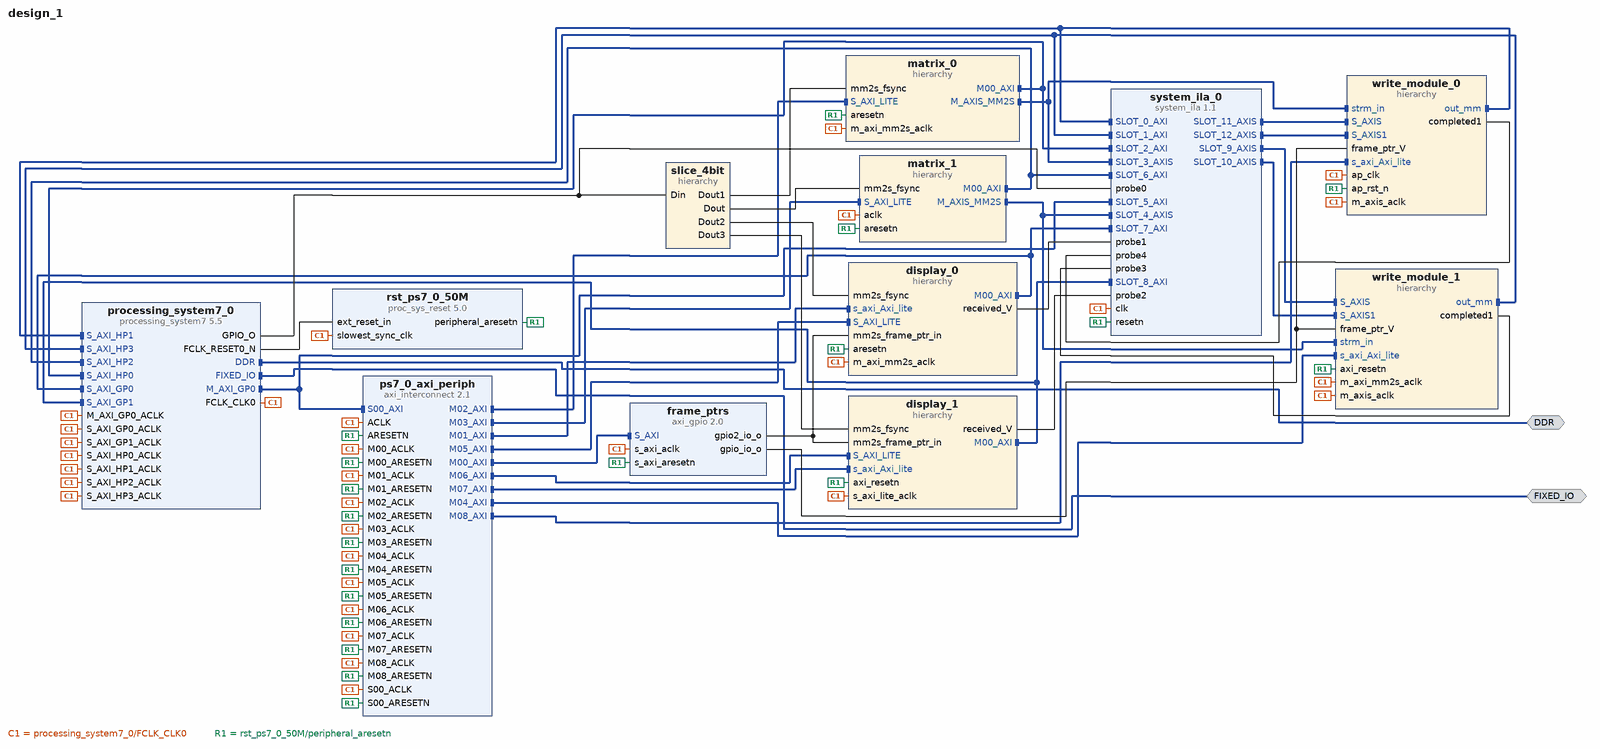
[diagram p0: block diagram of the top level]
# Vivado block design design_1, xc7z020clg400-1, Vivado 2023.1
create_bd_design design_1

create_bd_intf_port -mode Master -vlnv xilinx.com:interface:ddrx_rtl:1.0 DDR
create_bd_intf_port -mode Master -vlnv xilinx.com:display_processing_system7:fixedio_rtl:1.0 FIXED_IO

create_bd_cell -type hier display_0
create_bd_cell -type hier display_1
create_bd_cell -type ip -vlnv xilinx.com:ip:axi_gpio:2.0 frame_ptrs
set_property -dict [list \
  CONFIG.C_ALL_OUTPUTS 1 \
  CONFIG.C_ALL_OUTPUTS_2 1 \
  CONFIG.C_GPIO2_WIDTH 6 \
  CONFIG.C_GPIO_WIDTH 2 \
  CONFIG.C_IS_DUAL 1 \
] [get_bd_cells frame_ptrs]
create_bd_cell -type hier matrix_0
create_bd_cell -type hier matrix_1
create_bd_cell -type ip -vlnv xilinx.com:ip:processing_system7:5.5 processing_system7_0
set_property -dict [list \
  CONFIG.PCW_APU_PERIPHERAL_FREQMHZ 667 \
  CONFIG.PCW_ENET0_ENET0_IO {MIO 16 .. 27} \
  CONFIG.PCW_ENET0_GRP_MDIO_ENABLE 1 \
  CONFIG.PCW_ENET0_GRP_MDIO_IO {MIO 52 .. 53} \
  CONFIG.PCW_ENET0_PERIPHERAL_ENABLE 1 \
  CONFIG.PCW_ENET0_RESET_ENABLE 0 \
  CONFIG.PCW_ENET_RESET_ENABLE 1 \
  CONFIG.PCW_ENET_RESET_SELECT {Share reset pin} \
  CONFIG.PCW_FPGA0_PERIPHERAL_FREQMHZ 100 \
  CONFIG.PCW_FPGA1_PERIPHERAL_FREQMHZ 100 \
  CONFIG.PCW_FPGA2_PERIPHERAL_FREQMHZ 100 \
  CONFIG.PCW_GPIO_EMIO_GPIO_ENABLE 1 \
  CONFIG.PCW_GPIO_EMIO_GPIO_IO 4 \
  CONFIG.PCW_GPIO_EMIO_GPIO_WIDTH 4 \
  CONFIG.PCW_GPIO_MIO_GPIO_ENABLE 1 \
  CONFIG.PCW_GPIO_MIO_GPIO_IO MIO \
  CONFIG.PCW_I2C_RESET_ENABLE 1 \
  CONFIG.PCW_PRESET_BANK1_VOLTAGE {LVCMOS 1.8V} \
  CONFIG.PCW_QSPI_GRP_FBCLK_ENABLE 1 \
  CONFIG.PCW_QSPI_GRP_FBCLK_IO {MIO 8} \
  CONFIG.PCW_QSPI_GRP_SINGLE_SS_ENABLE 1 \
  CONFIG.PCW_QSPI_GRP_SINGLE_SS_IO {MIO 1 .. 6} \
  CONFIG.PCW_QSPI_PERIPHERAL_ENABLE 1 \
  CONFIG.PCW_QSPI_QSPI_IO {MIO 1 .. 6} \
  CONFIG.PCW_SD0_GRP_CD_ENABLE 1 \
  CONFIG.PCW_SD0_GRP_CD_IO {MIO 47} \
  CONFIG.PCW_SD0_GRP_WP_ENABLE 0 \
  CONFIG.PCW_SD0_PERIPHERAL_ENABLE 1 \
  CONFIG.PCW_SD0_SD0_IO {MIO 40 .. 45} \
  CONFIG.PCW_SDIO_PERIPHERAL_FREQMHZ 50 \
  CONFIG.PCW_SINGLE_QSPI_DATA_MODE x4 \
  CONFIG.PCW_S_AXI_HP1_DATA_WIDTH 32 \
  CONFIG.PCW_S_AXI_HP3_DATA_WIDTH 32 \
  CONFIG.PCW_UART1_PERIPHERAL_ENABLE 1 \
  CONFIG.PCW_UART1_UART1_IO {MIO 48 .. 49} \
  CONFIG.PCW_UART_PERIPHERAL_FREQMHZ 100 \
  CONFIG.PCW_UIPARAM_DDR_FREQ_MHZ 533.333333 \
  CONFIG.PCW_UIPARAM_DDR_MEMORY_TYPE {DDR 3 (Low Voltage)} \
  CONFIG.PCW_UIPARAM_DDR_PARTNO {MT41K256M16 RE-125} \
  CONFIG.PCW_USB0_PERIPHERAL_ENABLE 1 \
  CONFIG.PCW_USB0_RESET_ENABLE 1 \
  CONFIG.PCW_USB0_RESET_IO {MIO 46} \
  CONFIG.PCW_USB0_USB0_IO {MIO 28 .. 39} \
  CONFIG.PCW_USB_RESET_ENABLE 1 \
  CONFIG.PCW_USB_RESET_SELECT {Share reset pin} \
  CONFIG.PCW_USE_S_AXI_GP0 1 \
  CONFIG.PCW_USE_S_AXI_GP1 1 \
  CONFIG.PCW_USE_S_AXI_HP0 1 \
  CONFIG.PCW_USE_S_AXI_HP1 1 \
  CONFIG.PCW_USE_S_AXI_HP2 1 \
  CONFIG.PCW_USE_S_AXI_HP3 1 \
] [get_bd_cells processing_system7_0]
# 298 more settings of processing_system7_0 are not shown: defaults, MIO pin electricals, DDR timing, and values the tool derives
create_bd_cell -type ip -vlnv xilinx.com:ip:axi_interconnect:2.1 ps7_0_axi_periph
set_property -dict {CONFIG.NUM_MI 9} [get_bd_cells ps7_0_axi_periph]
create_bd_cell -type ip -vlnv xilinx.com:ip:proc_sys_reset:5.0 rst_ps7_0_50M
create_bd_cell -type hier slice_4bit
create_bd_cell -type ip -vlnv xilinx.com:ip:system_ila:1.1 system_ila_0
set_property -dict [list \
  CONFIG.C_DATA_DEPTH 2048 \
  CONFIG.C_MON_TYPE MIX \
  CONFIG.C_NUM_MONITOR_SLOTS 13 \
  CONFIG.C_NUM_OF_PROBES 5 \
  CONFIG.C_PROBE1_TYPE 0 \
  CONFIG.C_PROBE2_TYPE 0 \
  CONFIG.C_PROBE3_TYPE 0 \
  CONFIG.C_PROBE4_TYPE 0 \
  CONFIG.C_SLOT 6 \
  CONFIG.C_SLOT_0_APC_EN 0 \
  CONFIG.C_SLOT_0_AXI_AR_SEL_DATA 1 \
  CONFIG.C_SLOT_0_AXI_AR_SEL_TRIG 1 \
  CONFIG.C_SLOT_0_AXI_AW_SEL_DATA 1 \
  CONFIG.C_SLOT_0_AXI_AW_SEL_TRIG 1 \
  CONFIG.C_SLOT_0_AXI_B_SEL_DATA 1 \
  CONFIG.C_SLOT_0_AXI_B_SEL_TRIG 1 \
  CONFIG.C_SLOT_0_AXI_R_SEL_DATA 1 \
  CONFIG.C_SLOT_0_AXI_R_SEL_TRIG 1 \
  CONFIG.C_SLOT_0_AXI_W_SEL_DATA 1 \
  CONFIG.C_SLOT_0_AXI_W_SEL_TRIG 1 \
  CONFIG.C_SLOT_0_INTF_TYPE xilinx.com:interface:aximm_rtl:1.0 \
  CONFIG.C_SLOT_10_APC_EN 0 \
  CONFIG.C_SLOT_10_AXI_DATA_SEL 1 \
  CONFIG.C_SLOT_10_AXI_TRIG_SEL 1 \
  CONFIG.C_SLOT_10_INTF_TYPE xilinx.com:interface:axis_rtl:1.0 \
  CONFIG.C_SLOT_11_APC_EN 0 \
  CONFIG.C_SLOT_11_AXI_DATA_SEL 1 \
  CONFIG.C_SLOT_11_AXI_TRIG_SEL 1 \
  CONFIG.C_SLOT_11_INTF_TYPE xilinx.com:interface:axis_rtl:1.0 \
  CONFIG.C_SLOT_12_APC_EN 0 \
  CONFIG.C_SLOT_12_AXI_DATA_SEL 1 \
  CONFIG.C_SLOT_12_AXI_TRIG_SEL 1 \
  CONFIG.C_SLOT_12_INTF_TYPE xilinx.com:interface:axis_rtl:1.0 \
  CONFIG.C_SLOT_1_APC_EN 0 \
  CONFIG.C_SLOT_1_AXI_AR_SEL_DATA 1 \
  CONFIG.C_SLOT_1_AXI_AR_SEL_TRIG 1 \
  CONFIG.C_SLOT_1_AXI_AW_SEL_DATA 1 \
  CONFIG.C_SLOT_1_AXI_AW_SEL_TRIG 1 \
  CONFIG.C_SLOT_1_AXI_B_SEL_DATA 1 \
  CONFIG.C_SLOT_1_AXI_B_SEL_TRIG 1 \
  CONFIG.C_SLOT_1_AXI_R_SEL_DATA 1 \
  CONFIG.C_SLOT_1_AXI_R_SEL_TRIG 1 \
  CONFIG.C_SLOT_1_AXI_W_SEL_DATA 1 \
  CONFIG.C_SLOT_1_AXI_W_SEL_TRIG 1 \
  CONFIG.C_SLOT_1_INTF_TYPE xilinx.com:interface:aximm_rtl:1.0 \
  CONFIG.C_SLOT_2_APC_EN 0 \
  CONFIG.C_SLOT_2_AXI_AR_SEL_DATA 1 \
  CONFIG.C_SLOT_2_AXI_AR_SEL_TRIG 1 \
  CONFIG.C_SLOT_2_AXI_AW_SEL_DATA 0 \
  CONFIG.C_SLOT_2_AXI_AW_SEL_TRIG 0 \
  CONFIG.C_SLOT_2_AXI_B_SEL_DATA 0 \
  CONFIG.C_SLOT_2_AXI_B_SEL_TRIG 0 \
  CONFIG.C_SLOT_2_AXI_R_SEL_DATA 1 \
  CONFIG.C_SLOT_2_AXI_R_SEL_TRIG 0 \
  CONFIG.C_SLOT_2_AXI_W_SEL_DATA 0 \
  CONFIG.C_SLOT_2_AXI_W_SEL_TRIG 0 \
  CONFIG.C_SLOT_2_INTF_TYPE xilinx.com:interface:aximm_rtl:1.0 \
  CONFIG.C_SLOT_3_APC_EN 0 \
  CONFIG.C_SLOT_3_AXI_DATA_SEL 1 \
  CONFIG.C_SLOT_3_AXI_TRIG_SEL 1 \
  CONFIG.C_SLOT_3_INTF_TYPE xilinx.com:interface:axis_rtl:1.0 \
  CONFIG.C_SLOT_4_APC_EN 0 \
  CONFIG.C_SLOT_4_AXI_DATA_SEL 1 \
  CONFIG.C_SLOT_4_AXI_TRIG_SEL 1 \
  CONFIG.C_SLOT_4_INTF_TYPE xilinx.com:interface:axis_rtl:1.0 \
  CONFIG.C_SLOT_5_APC_EN 0 \
  CONFIG.C_SLOT_5_AXI_AR_SEL_DATA 1 \
  CONFIG.C_SLOT_5_AXI_AR_SEL_TRIG 0 \
  CONFIG.C_SLOT_5_AXI_AW_SEL_DATA 1 \
  CONFIG.C_SLOT_5_AXI_AW_SEL_TRIG 0 \
  CONFIG.C_SLOT_5_AXI_B_SEL_DATA 1 \
  CONFIG.C_SLOT_5_AXI_B_SEL_TRIG 0 \
  CONFIG.C_SLOT_5_AXI_R_SEL_DATA 1 \
  CONFIG.C_SLOT_5_AXI_R_SEL_TRIG 1 \
  CONFIG.C_SLOT_5_AXI_W_SEL_DATA 1 \
  CONFIG.C_SLOT_5_AXI_W_SEL_TRIG 0 \
  CONFIG.C_SLOT_5_INTF_TYPE xilinx.com:interface:aximm_rtl:1.0 \
  CONFIG.C_SLOT_6_APC_EN 0 \
  CONFIG.C_SLOT_6_AXI_AR_SEL_DATA 1 \
  CONFIG.C_SLOT_6_AXI_AR_SEL_TRIG 1 \
  CONFIG.C_SLOT_6_AXI_AW_SEL 0 \
  CONFIG.C_SLOT_6_AXI_AW_SEL_DATA 0 \
  CONFIG.C_SLOT_6_AXI_AW_SEL_TRIG 0 \
  CONFIG.C_SLOT_6_AXI_B_SEL 1 \
  CONFIG.C_SLOT_6_AXI_B_SEL_DATA 0 \
  CONFIG.C_SLOT_6_AXI_B_SEL_TRIG 1 \
  CONFIG.C_SLOT_6_AXI_R_SEL_DATA 1 \
  CONFIG.C_SLOT_6_AXI_R_SEL_TRIG 1 \
  CONFIG.C_SLOT_6_AXI_W_SEL 1 \
  CONFIG.C_SLOT_6_AXI_W_SEL_DATA 0 \
  CONFIG.C_SLOT_6_AXI_W_SEL_TRIG 1 \
  CONFIG.C_SLOT_6_INTF_TYPE xilinx.com:interface:aximm_rtl:1.0 \
  CONFIG.C_SLOT_7_APC_EN 0 \
  CONFIG.C_SLOT_7_AXI_AR_SEL_DATA 1 \
  CONFIG.C_SLOT_7_AXI_AR_SEL_TRIG 1 \
  CONFIG.C_SLOT_7_AXI_AW_SEL 0 \
  CONFIG.C_SLOT_7_AXI_AW_SEL_DATA 0 \
  CONFIG.C_SLOT_7_AXI_AW_SEL_TRIG 0 \
  CONFIG.C_SLOT_7_AXI_B_SEL 0 \
  CONFIG.C_SLOT_7_AXI_B_SEL_DATA 0 \
  CONFIG.C_SLOT_7_AXI_B_SEL_TRIG 0 \
  CONFIG.C_SLOT_7_AXI_R_SEL_DATA 1 \
  CONFIG.C_SLOT_7_AXI_R_SEL_TRIG 0 \
  CONFIG.C_SLOT_7_AXI_W_SEL 1 \
  CONFIG.C_SLOT_7_AXI_W_SEL_DATA 0 \
  CONFIG.C_SLOT_7_AXI_W_SEL_TRIG 1 \
  CONFIG.C_SLOT_7_INTF_TYPE xilinx.com:interface:aximm_rtl:1.0 \
  CONFIG.C_SLOT_8_APC_EN 0 \
  CONFIG.C_SLOT_8_AXI_AR_SEL_DATA 1 \
  CONFIG.C_SLOT_8_AXI_AR_SEL_TRIG 1 \
  CONFIG.C_SLOT_8_AXI_AW_SEL_DATA 0 \
  CONFIG.C_SLOT_8_AXI_AW_SEL_TRIG 0 \
  CONFIG.C_SLOT_8_AXI_B_SEL_DATA 0 \
  CONFIG.C_SLOT_8_AXI_B_SEL_TRIG 0 \
  CONFIG.C_SLOT_8_AXI_R_SEL_DATA 1 \
  CONFIG.C_SLOT_8_AXI_R_SEL_TRIG 0 \
  CONFIG.C_SLOT_8_AXI_W_SEL_DATA 0 \
  CONFIG.C_SLOT_8_AXI_W_SEL_TRIG 0 \
  CONFIG.C_SLOT_8_INTF_TYPE xilinx.com:interface:aximm_rtl:1.0 \
  CONFIG.C_SLOT_9_APC_EN 0 \
  CONFIG.C_SLOT_9_AXI_DATA_SEL 1 \
  CONFIG.C_SLOT_9_AXI_TRIG_SEL 1 \
  CONFIG.C_SLOT_9_INTF_TYPE xilinx.com:interface:axis_rtl:1.0 \
] [get_bd_cells system_ila_0]
create_bd_cell -type hier write_module_0
create_bd_cell -type hier write_module_1

# ---- hierarchy /display_0 ----
current_bd_instance /display_0
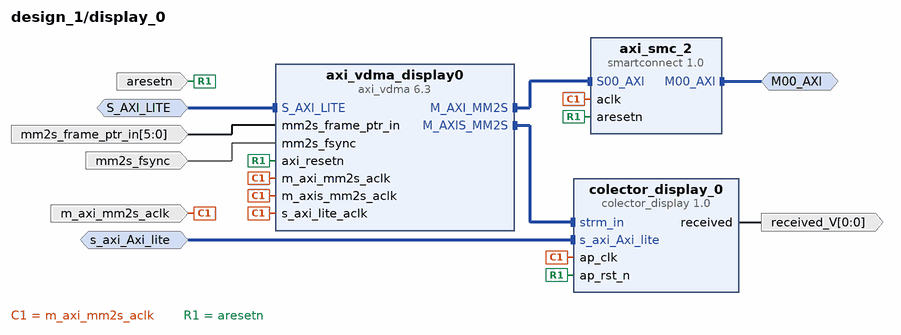
[diagram p1: block diagram inside /display_0]
create_bd_intf_pin -mode Master -vlnv xilinx.com:interface:aximm_rtl:1.0 M00_AXI
create_bd_intf_pin -mode Slave -vlnv xilinx.com:interface:aximm_rtl:1.0 S_AXI_LITE
create_bd_intf_pin -mode Slave -vlnv xilinx.com:interface:aximm_rtl:1.0 s_axi_Axi_lite
create_bd_pin -dir I -type rst aresetn
create_bd_pin -dir I -type clk m_axi_mm2s_aclk
create_bd_pin -dir I -from 5 -to 0 mm2s_frame_ptr_in
create_bd_pin -dir I mm2s_fsync
create_bd_pin -dir O -from 0 -to 0 -type data received_V

create_bd_cell -type ip -vlnv xilinx.com:ip:smartconnect:1.0 axi_smc_2
set_property -dict {CONFIG.NUM_SI 1} [get_bd_cells axi_smc_2]
create_bd_cell -type ip -vlnv xilinx.com:ip:axi_vdma:6.3 axi_vdma_display0
set_property -dict [list \
  CONFIG.c_include_s2mm 0 \
  CONFIG.c_m_axis_mm2s_tdata_width 64 \
  CONFIG.c_mm2s_genlock_mode 1 \
  CONFIG.c_mm2s_linebuffer_depth 1024 \
  CONFIG.c_mm2s_max_burst_length 256 \
  CONFIG.c_num_fstores 4 \
  CONFIG.c_use_mm2s_fsync 1 \
] [get_bd_cells axi_vdma_display0]
create_bd_cell -type ip -vlnv xilinx.com:hls:colector_display:1.0 colector_display_0

# ---- hierarchy /display_1 ----
current_bd_instance /display_1
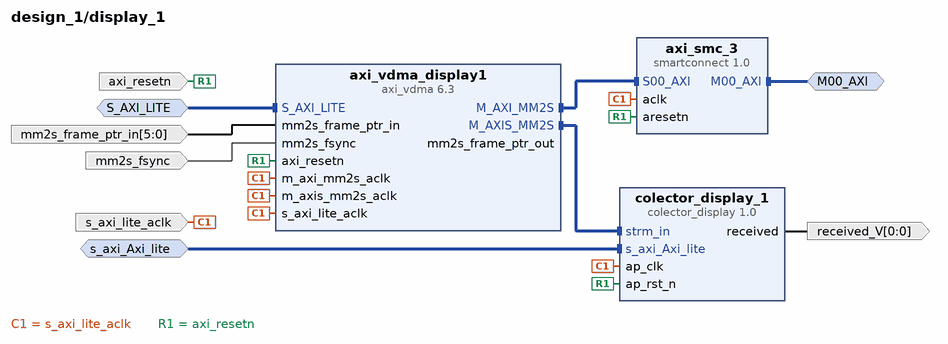
[diagram p2: block diagram inside /display_1]
create_bd_intf_pin -mode Master -vlnv xilinx.com:interface:aximm_rtl:1.0 M00_AXI
create_bd_intf_pin -mode Slave -vlnv xilinx.com:interface:aximm_rtl:1.0 S_AXI_LITE
create_bd_intf_pin -mode Slave -vlnv xilinx.com:interface:aximm_rtl:1.0 s_axi_Axi_lite
create_bd_pin -dir I -type rst axi_resetn
create_bd_pin -dir I -from 5 -to 0 mm2s_frame_ptr_in
create_bd_pin -dir I mm2s_fsync
create_bd_pin -dir O -from 0 -to 0 -type data received_V
create_bd_pin -dir I -type clk s_axi_lite_aclk

create_bd_cell -type ip -vlnv xilinx.com:ip:smartconnect:1.0 axi_smc_3
set_property -dict {CONFIG.NUM_SI 1} [get_bd_cells axi_smc_3]
create_bd_cell -type ip -vlnv xilinx.com:ip:axi_vdma:6.3 axi_vdma_display1
set_property -dict [list \
  CONFIG.c_include_s2mm 0 \
  CONFIG.c_m_axis_mm2s_tdata_width 64 \
  CONFIG.c_mm2s_genlock_mode 1 \
  CONFIG.c_mm2s_linebuffer_depth 1024 \
  CONFIG.c_mm2s_max_burst_length 256 \
  CONFIG.c_num_fstores 4 \
  CONFIG.c_use_mm2s_fsync 1 \
] [get_bd_cells axi_vdma_display1]
create_bd_cell -type ip -vlnv xilinx.com:hls:colector_display:1.0 colector_display_1

# ---- hierarchy /matrix_0 ----
current_bd_instance /matrix_0
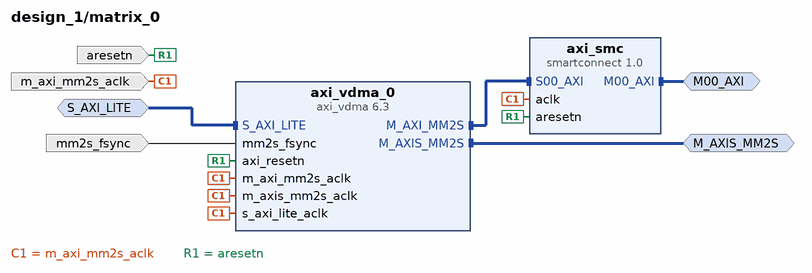
[diagram p3: block diagram inside /matrix_0]
create_bd_intf_pin -mode Master -vlnv xilinx.com:interface:aximm_rtl:1.0 M00_AXI
create_bd_intf_pin -mode Master -vlnv xilinx.com:interface:axis_rtl:1.0 M_AXIS_MM2S
create_bd_intf_pin -mode Slave -vlnv xilinx.com:interface:aximm_rtl:1.0 S_AXI_LITE
create_bd_pin -dir I -type rst aresetn
create_bd_pin -dir I -type clk m_axi_mm2s_aclk
create_bd_pin -dir I mm2s_fsync

create_bd_cell -type ip -vlnv xilinx.com:ip:smartconnect:1.0 axi_smc
set_property -dict {CONFIG.NUM_SI 1} [get_bd_cells axi_smc]
create_bd_cell -type ip -vlnv xilinx.com:ip:axi_vdma:6.3 axi_vdma_0
set_property -dict [list \
  CONFIG.c_include_s2mm 0 \
  CONFIG.c_m_axis_mm2s_tdata_width 64 \
  CONFIG.c_mm2s_genlock_mode 0 \
  CONFIG.c_num_fstores 1 \
  CONFIG.c_use_mm2s_fsync 1 \
] [get_bd_cells axi_vdma_0]

# ---- hierarchy /matrix_1 ----
current_bd_instance /matrix_1
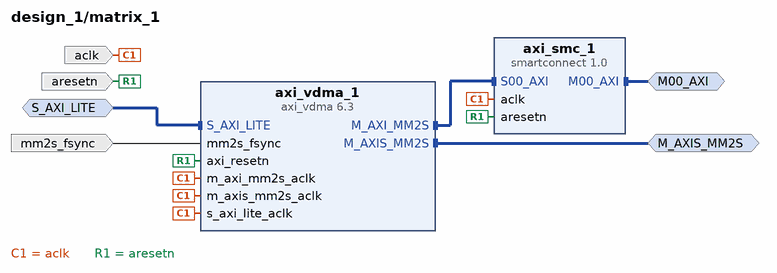
[diagram p4: block diagram inside /matrix_1]
create_bd_intf_pin -mode Master -vlnv xilinx.com:interface:aximm_rtl:1.0 M00_AXI
create_bd_intf_pin -mode Master -vlnv xilinx.com:interface:axis_rtl:1.0 M_AXIS_MM2S
create_bd_intf_pin -mode Slave -vlnv xilinx.com:interface:aximm_rtl:1.0 S_AXI_LITE
create_bd_pin -dir I -type clk aclk
create_bd_pin -dir I -type rst aresetn
create_bd_pin -dir I mm2s_fsync

create_bd_cell -type ip -vlnv xilinx.com:ip:smartconnect:1.0 axi_smc_1
set_property -dict {CONFIG.NUM_SI 1} [get_bd_cells axi_smc_1]
create_bd_cell -type ip -vlnv xilinx.com:ip:axi_vdma:6.3 axi_vdma_1
set_property -dict [list \
  CONFIG.c_include_s2mm 0 \
  CONFIG.c_m_axis_mm2s_tdata_width 64 \
  CONFIG.c_mm2s_genlock_mode 0 \
  CONFIG.c_num_fstores 1 \
  CONFIG.c_use_mm2s_fsync 1 \
] [get_bd_cells axi_vdma_1]

# ---- hierarchy /slice_4bit ----
current_bd_instance /slice_4bit
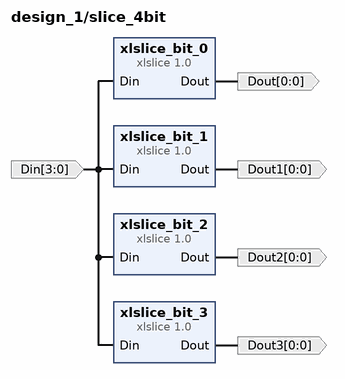
[diagram p5: block diagram inside /slice_4bit]
create_bd_pin -dir I -from 3 -to 0 Din
create_bd_pin -dir O -from 0 -to 0 Dout
create_bd_pin -dir O -from 0 -to 0 Dout1
create_bd_pin -dir O -from 0 -to 0 Dout2
create_bd_pin -dir O -from 0 -to 0 Dout3

create_bd_cell -type ip -vlnv xilinx.com:ip:xlslice:1.0 xlslice_bit_0
set_property -dict {CONFIG.DIN_FROM 0 CONFIG.DIN_TO 0 CONFIG.DIN_WIDTH 4} [get_bd_cells xlslice_bit_0]
create_bd_cell -type ip -vlnv xilinx.com:ip:xlslice:1.0 xlslice_bit_1
set_property -dict {CONFIG.DIN_FROM 1 CONFIG.DIN_TO 1 CONFIG.DIN_WIDTH 4 CONFIG.DOUT_WIDTH 1} [get_bd_cells xlslice_bit_1]
create_bd_cell -type ip -vlnv xilinx.com:ip:xlslice:1.0 xlslice_bit_2
set_property -dict {CONFIG.DIN_FROM 2 CONFIG.DIN_TO 2 CONFIG.DIN_WIDTH 4 CONFIG.DOUT_WIDTH 1} [get_bd_cells xlslice_bit_2]
create_bd_cell -type ip -vlnv xilinx.com:ip:xlslice:1.0 xlslice_bit_3
set_property -dict {CONFIG.DIN_FROM 3 CONFIG.DIN_TO 3 CONFIG.DIN_WIDTH 4 CONFIG.DOUT_WIDTH 1} [get_bd_cells xlslice_bit_3]

# ---- hierarchy /write_module_0 ----
current_bd_instance /write_module_0
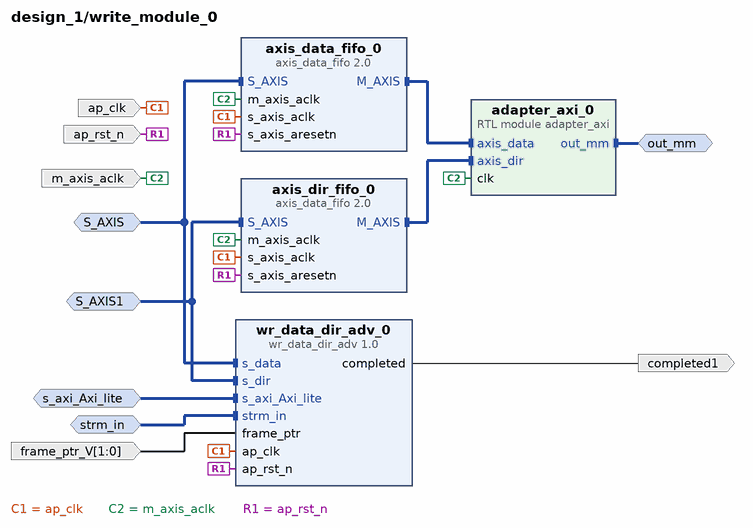
[diagram p6: block diagram inside /write_module_0]
create_bd_intf_pin -mode Monitor -vlnv xilinx.com:interface:axis_rtl:1.0 S_AXIS
create_bd_intf_pin -mode Monitor -vlnv xilinx.com:interface:axis_rtl:1.0 S_AXIS1
create_bd_intf_pin -mode Master -vlnv xilinx.com:interface:aximm_rtl:1.0 out_mm
create_bd_intf_pin -mode Slave -vlnv xilinx.com:interface:aximm_rtl:1.0 s_axi_Axi_lite
create_bd_intf_pin -mode Slave -vlnv xilinx.com:interface:axis_rtl:1.0 strm_in
create_bd_pin -dir I -type clk ap_clk
create_bd_pin -dir I -type rst ap_rst_n
create_bd_pin -dir O -type data completed1
create_bd_pin -dir I -from 1 -to 0 -type data frame_ptr_V
create_bd_pin -dir I -type clk m_axis_aclk

create_bd_cell -type module -reference adapter_axi adapter_axi_0
create_bd_cell -type ip -vlnv xilinx.com:ip:axis_data_fifo:2.0 axis_data_fifo_0
set_property -dict [list \
  CONFIG.FIFO_DEPTH 512 \
  CONFIG.HAS_PROG_EMPTY 0 \
  CONFIG.HAS_PROG_FULL 0 \
  CONFIG.HAS_RD_DATA_COUNT 0 \
  CONFIG.HAS_WR_DATA_COUNT 0 \
  CONFIG.IS_ACLK_ASYNC 1 \
] [get_bd_cells axis_data_fifo_0]
create_bd_cell -type ip -vlnv xilinx.com:ip:axis_data_fifo:2.0 axis_dir_fifo_0
set_property -dict [list \
  CONFIG.FIFO_DEPTH 512 \
  CONFIG.HAS_PROG_EMPTY 0 \
  CONFIG.HAS_PROG_FULL 0 \
  CONFIG.HAS_RD_DATA_COUNT 0 \
  CONFIG.HAS_WR_DATA_COUNT 0 \
  CONFIG.IS_ACLK_ASYNC 1 \
] [get_bd_cells axis_dir_fifo_0]
create_bd_cell -type ip -vlnv xilinx.com:hls:wr_data_dir_adv:1.0 wr_data_dir_adv_0

# ---- hierarchy /write_module_1 ----
current_bd_instance /write_module_1
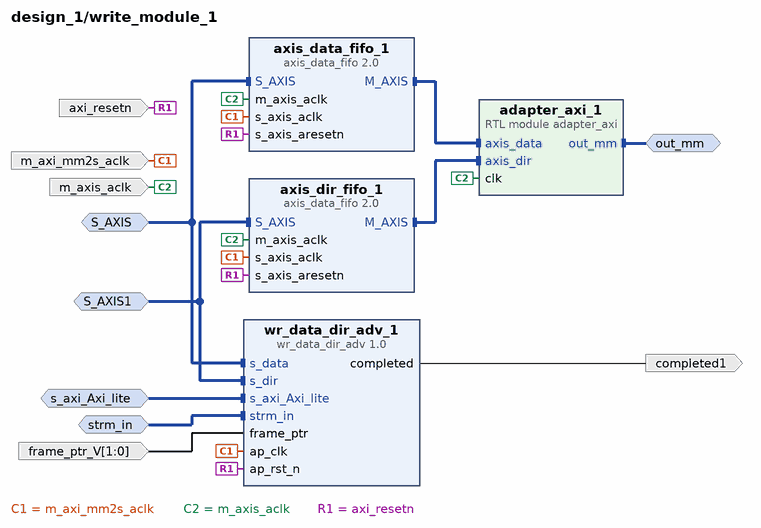
[diagram p7: block diagram inside /write_module_1]
create_bd_intf_pin -mode Monitor -vlnv xilinx.com:interface:axis_rtl:1.0 S_AXIS
create_bd_intf_pin -mode Monitor -vlnv xilinx.com:interface:axis_rtl:1.0 S_AXIS1
create_bd_intf_pin -mode Master -vlnv xilinx.com:interface:aximm_rtl:1.0 out_mm
create_bd_intf_pin -mode Slave -vlnv xilinx.com:interface:aximm_rtl:1.0 s_axi_Axi_lite
create_bd_intf_pin -mode Slave -vlnv xilinx.com:interface:axis_rtl:1.0 strm_in
create_bd_pin -dir I -type rst axi_resetn
create_bd_pin -dir O -type data completed1
create_bd_pin -dir I -from 1 -to 0 -type data frame_ptr_V
create_bd_pin -dir I -type clk m_axi_mm2s_aclk
create_bd_pin -dir I -type clk m_axis_aclk

create_bd_cell -type module -reference adapter_axi adapter_axi_1
create_bd_cell -type ip -vlnv xilinx.com:ip:axis_data_fifo:2.0 axis_data_fifo_1
set_property -dict [list \
  CONFIG.FIFO_DEPTH 512 \
  CONFIG.HAS_AEMPTY 0 \
  CONFIG.HAS_AFULL 0 \
  CONFIG.IS_ACLK_ASYNC 1 \
] [get_bd_cells axis_data_fifo_1]
create_bd_cell -type ip -vlnv xilinx.com:ip:axis_data_fifo:2.0 axis_dir_fifo_1
set_property -dict [list \
  CONFIG.HAS_AEMPTY 0 \
  CONFIG.HAS_AFULL 0 \
  CONFIG.HAS_WR_DATA_COUNT 0 \
  CONFIG.IS_ACLK_ASYNC 1 \
] [get_bd_cells axis_dir_fifo_1]
create_bd_cell -type ip -vlnv xilinx.com:hls:wr_data_dir_adv:1.0 wr_data_dir_adv_1

# ---- connections ----

current_bd_instance /display_0
connect_bd_intf_net -intf_net axi_smc_2_M00_AXI [get_bd_intf_pins M00_AXI] [get_bd_intf_pins axi_smc_2/M00_AXI]
connect_bd_intf_net [get_bd_intf_pins axi_vdma_display0/M_AXIS_MM2S] [get_bd_intf_pins colector_display_0/strm_in]
connect_bd_intf_net [get_bd_intf_pins axi_smc_2/S00_AXI] [get_bd_intf_pins axi_vdma_display0/M_AXI_MM2S]
connect_bd_intf_net [get_bd_intf_pins s_axi_Axi_lite] [get_bd_intf_pins colector_display_0/s_axi_Axi_lite]
connect_bd_intf_net [get_bd_intf_pins S_AXI_LITE] [get_bd_intf_pins axi_vdma_display0/S_AXI_LITE]
connect_bd_net -net processing_system7_0_FCLK_CLK0 [get_bd_pins m_axi_mm2s_aclk] \
  [get_bd_pins axi_smc_2/aclk] [get_bd_pins axi_vdma_display0/m_axi_mm2s_aclk] \
  [get_bd_pins axi_vdma_display0/m_axis_mm2s_aclk] [get_bd_pins axi_vdma_display0/s_axi_lite_aclk] \
  [get_bd_pins colector_display_0/ap_clk]
connect_bd_net -net received_V_1 [get_bd_pins colector_display_0/received] [get_bd_pins received_V]
connect_bd_net -net rst_ps7_0_50M_peripheral_aresetn [get_bd_pins aresetn] \
  [get_bd_pins axi_smc_2/aresetn] [get_bd_pins axi_vdma_display0/axi_resetn] [get_bd_pins colector_display_0/ap_rst_n]
connect_bd_net -net xlconstant_0_dout [get_bd_pins mm2s_frame_ptr_in] [get_bd_pins axi_vdma_display0/mm2s_frame_ptr_in]
connect_bd_net -net xlslice_bit_2_Dout [get_bd_pins mm2s_fsync] [get_bd_pins axi_vdma_display0/mm2s_fsync]
set_property HDL_ATTRIBUTE.DEBUG true [get_bd_intf_nets axi_smc_2_M00_AXI]
set_property HDL_ATTRIBUTE.DEBUG true [get_bd_nets received_V_1]

current_bd_instance /display_1
connect_bd_intf_net -intf_net axi_smc_3_M00_AXI [get_bd_intf_pins M00_AXI] [get_bd_intf_pins axi_smc_3/M00_AXI]
connect_bd_intf_net [get_bd_intf_pins axi_vdma_display1/M_AXIS_MM2S] [get_bd_intf_pins colector_display_1/strm_in]
connect_bd_intf_net [get_bd_intf_pins axi_smc_3/S00_AXI] [get_bd_intf_pins axi_vdma_display1/M_AXI_MM2S]
connect_bd_intf_net [get_bd_intf_pins S_AXI_LITE] [get_bd_intf_pins axi_vdma_display1/S_AXI_LITE]
connect_bd_intf_net [get_bd_intf_pins s_axi_Axi_lite] [get_bd_intf_pins colector_display_1/s_axi_Axi_lite]
# net mm2s_frame_ptr_out has one end: axi_vdma_display1/mm2s_frame_ptr_out
connect_bd_net -net processing_system7_0_FCLK_CLK0 [get_bd_pins s_axi_lite_aclk] \
  [get_bd_pins axi_smc_3/aclk] [get_bd_pins axi_vdma_display1/m_axi_mm2s_aclk] \
  [get_bd_pins axi_vdma_display1/m_axis_mm2s_aclk] [get_bd_pins axi_vdma_display1/s_axi_lite_aclk] \
  [get_bd_pins colector_display_1/ap_clk]
connect_bd_net -net received_V [get_bd_pins colector_display_1/received] [get_bd_pins received_V]
connect_bd_net -net rst_ps7_0_50M_peripheral_aresetn [get_bd_pins axi_resetn] \
  [get_bd_pins axi_smc_3/aresetn] [get_bd_pins axi_vdma_display1/axi_resetn] [get_bd_pins colector_display_1/ap_rst_n]
connect_bd_net -net xlconstant_0_dout [get_bd_pins mm2s_frame_ptr_in] [get_bd_pins axi_vdma_display1/mm2s_frame_ptr_in]
connect_bd_net -net xlslice_bit_3_Dout [get_bd_pins mm2s_fsync] [get_bd_pins axi_vdma_display1/mm2s_fsync]
set_property HDL_ATTRIBUTE.DEBUG true [get_bd_intf_nets axi_smc_3_M00_AXI]
set_property HDL_ATTRIBUTE.DEBUG true [get_bd_nets received_V]

current_bd_instance /matrix_0
connect_bd_intf_net -intf_net axi_smc_M00_AXI [get_bd_intf_pins M00_AXI] [get_bd_intf_pins axi_smc/M00_AXI]
connect_bd_intf_net -intf_net axi_vdma_0_M_AXIS_MM2S [get_bd_intf_pins M_AXIS_MM2S] [get_bd_intf_pins axi_vdma_0/M_AXIS_MM2S]
connect_bd_intf_net [get_bd_intf_pins axi_smc/S00_AXI] [get_bd_intf_pins axi_vdma_0/M_AXI_MM2S]
connect_bd_intf_net [get_bd_intf_pins S_AXI_LITE] [get_bd_intf_pins axi_vdma_0/S_AXI_LITE]
connect_bd_net -net processing_system7_0_FCLK_CLK0 [get_bd_pins m_axi_mm2s_aclk] \
  [get_bd_pins axi_smc/aclk] [get_bd_pins axi_vdma_0/m_axi_mm2s_aclk] [get_bd_pins axi_vdma_0/m_axis_mm2s_aclk] \
  [get_bd_pins axi_vdma_0/s_axi_lite_aclk]
connect_bd_net -net rst_ps7_0_50M_peripheral_aresetn [get_bd_pins aresetn] [get_bd_pins axi_smc/aresetn] [get_bd_pins axi_vdma_0/axi_resetn]
connect_bd_net -net xlslice_bit_0_Dout [get_bd_pins mm2s_fsync] [get_bd_pins axi_vdma_0/mm2s_fsync]
set_property HDL_ATTRIBUTE.DEBUG true [get_bd_intf_nets axi_smc_M00_AXI]
set_property HDL_ATTRIBUTE.DEBUG true [get_bd_intf_nets axi_vdma_0_M_AXIS_MM2S]

current_bd_instance /matrix_1
connect_bd_intf_net -intf_net axi_smc_1_M00_AXI1 [get_bd_intf_pins M00_AXI] [get_bd_intf_pins axi_smc_1/M00_AXI]
connect_bd_intf_net -intf_net axi_vdma_1_M_AXIS_MM2S [get_bd_intf_pins M_AXIS_MM2S] [get_bd_intf_pins axi_vdma_1/M_AXIS_MM2S]
connect_bd_intf_net [get_bd_intf_pins axi_smc_1/S00_AXI] [get_bd_intf_pins axi_vdma_1/M_AXI_MM2S]
connect_bd_intf_net [get_bd_intf_pins S_AXI_LITE] [get_bd_intf_pins axi_vdma_1/S_AXI_LITE]
connect_bd_net -net processing_system7_0_FCLK_CLK0 [get_bd_pins aclk] \
  [get_bd_pins axi_smc_1/aclk] [get_bd_pins axi_vdma_1/m_axi_mm2s_aclk] [get_bd_pins axi_vdma_1/m_axis_mm2s_aclk] \
  [get_bd_pins axi_vdma_1/s_axi_lite_aclk]
connect_bd_net -net rst_ps7_0_50M_peripheral_aresetn [get_bd_pins aresetn] [get_bd_pins axi_smc_1/aresetn] [get_bd_pins axi_vdma_1/axi_resetn]
connect_bd_net -net xlslice_0_Dout [get_bd_pins mm2s_fsync] [get_bd_pins axi_vdma_1/mm2s_fsync]
set_property HDL_ATTRIBUTE.DEBUG true [get_bd_intf_nets axi_smc_1_M00_AXI1]
set_property HDL_ATTRIBUTE.DEBUG true [get_bd_intf_nets axi_vdma_1_M_AXIS_MM2S]

current_bd_instance /slice_4bit
connect_bd_net -net processing_system7_0_GPIO_O [get_bd_pins Din] \
  [get_bd_pins xlslice_bit_0/Din] [get_bd_pins xlslice_bit_1/Din] [get_bd_pins xlslice_bit_2/Din] \
  [get_bd_pins xlslice_bit_3/Din]
connect_bd_net -net xlslice_0_Dout [get_bd_pins xlslice_bit_1/Dout] [get_bd_pins Dout1]
connect_bd_net [get_bd_pins xlslice_bit_0/Dout] [get_bd_pins Dout]
connect_bd_net [get_bd_pins xlslice_bit_2/Dout] [get_bd_pins Dout2]
connect_bd_net [get_bd_pins xlslice_bit_3/Dout] [get_bd_pins Dout3]
set_property HDL_ATTRIBUTE.DEBUG true [get_bd_nets processing_system7_0_GPIO_O]

current_bd_instance /write_module_0
connect_bd_intf_net [get_bd_intf_pins s_axi_Axi_lite] [get_bd_intf_pins wr_data_dir_adv_0/s_axi_Axi_lite]
connect_bd_intf_net -intf_net Conn2 [get_bd_intf_pins strm_in] [get_bd_intf_pins wr_data_dir_adv_0/strm_in]
connect_bd_intf_net -intf_net adapter_axi_0_out_mm [get_bd_intf_pins out_mm] [get_bd_intf_pins adapter_axi_0/out_mm]
connect_bd_intf_net [get_bd_intf_pins adapter_axi_0/axis_data] [get_bd_intf_pins axis_data_fifo_0/M_AXIS]
connect_bd_intf_net [get_bd_intf_pins adapter_axi_0/axis_dir] [get_bd_intf_pins axis_dir_fifo_0/M_AXIS]
connect_bd_intf_net -intf_net wr_data_dir_adv_0_s_data [get_bd_intf_pins axis_data_fifo_0/S_AXIS] [get_bd_intf_pins wr_data_dir_adv_0/s_data]
connect_bd_intf_net [get_bd_intf_pins axis_data_fifo_0/S_AXIS] [get_bd_intf_pins S_AXIS]
connect_bd_intf_net -intf_net wr_data_dir_adv_0_s_dir [get_bd_intf_pins axis_dir_fifo_0/S_AXIS] [get_bd_intf_pins wr_data_dir_adv_0/s_dir]
connect_bd_intf_net [get_bd_intf_pins axis_dir_fifo_0/S_AXIS] [get_bd_intf_pins S_AXIS1]
connect_bd_net -net completed [get_bd_pins wr_data_dir_adv_0/completed] [get_bd_pins completed1]
connect_bd_net [get_bd_pins frame_ptr_V] [get_bd_pins wr_data_dir_adv_0/frame_ptr]
connect_bd_net -net processing_system7_0_FCLK_CLK0 [get_bd_pins ap_clk] \
  [get_bd_pins axis_data_fifo_0/s_axis_aclk] [get_bd_pins axis_dir_fifo_0/s_axis_aclk] [get_bd_pins wr_data_dir_adv_0/ap_clk]
connect_bd_net -net processing_system7_0_FCLK_CLK1 [get_bd_pins m_axis_aclk] \
  [get_bd_pins adapter_axi_0/clk] [get_bd_pins axis_data_fifo_0/m_axis_aclk] [get_bd_pins axis_dir_fifo_0/m_axis_aclk]
connect_bd_net -net rst_ps7_0_50M_peripheral_aresetn [get_bd_pins ap_rst_n] \
  [get_bd_pins axis_data_fifo_0/s_axis_aresetn] [get_bd_pins axis_dir_fifo_0/s_axis_aresetn] \
  [get_bd_pins wr_data_dir_adv_0/ap_rst_n]
set_property HDL_ATTRIBUTE.DEBUG true [get_bd_intf_nets Conn2]
set_property HDL_ATTRIBUTE.DEBUG true [get_bd_intf_nets adapter_axi_0_out_mm]
set_property HDL_ATTRIBUTE.DEBUG true [get_bd_intf_nets wr_data_dir_adv_0_s_data]
set_property HDL_ATTRIBUTE.MARK_DEBUG true [get_bd_intf_nets wr_data_dir_adv_0_s_data]
set_property HDL_ATTRIBUTE.DEBUG true [get_bd_intf_nets wr_data_dir_adv_0_s_dir]
set_property HDL_ATTRIBUTE.MARK_DEBUG true [get_bd_intf_nets wr_data_dir_adv_0_s_dir]
set_property HDL_ATTRIBUTE.DEBUG true [get_bd_nets completed]

current_bd_instance /write_module_1
connect_bd_intf_net [get_bd_intf_pins s_axi_Axi_lite] [get_bd_intf_pins wr_data_dir_adv_1/s_axi_Axi_lite]
connect_bd_intf_net -intf_net Conn2 [get_bd_intf_pins strm_in] [get_bd_intf_pins wr_data_dir_adv_1/strm_in]
connect_bd_intf_net -intf_net adapter_axi_1_out_mm [get_bd_intf_pins out_mm] [get_bd_intf_pins adapter_axi_1/out_mm]
connect_bd_intf_net [get_bd_intf_pins adapter_axi_1/axis_data] [get_bd_intf_pins axis_data_fifo_1/M_AXIS]
connect_bd_intf_net [get_bd_intf_pins adapter_axi_1/axis_dir] [get_bd_intf_pins axis_dir_fifo_1/M_AXIS]
connect_bd_intf_net -intf_net wr_data_dir_adv_0_s_data [get_bd_intf_pins axis_data_fifo_1/S_AXIS] [get_bd_intf_pins wr_data_dir_adv_1/s_data]
connect_bd_intf_net [get_bd_intf_pins axis_data_fifo_1/S_AXIS] [get_bd_intf_pins S_AXIS]
connect_bd_intf_net -intf_net wr_data_dir_adv_0_s_dir [get_bd_intf_pins axis_dir_fifo_1/S_AXIS] [get_bd_intf_pins wr_data_dir_adv_1/s_dir]
connect_bd_intf_net [get_bd_intf_pins axis_dir_fifo_1/S_AXIS] [get_bd_intf_pins S_AXIS1]
connect_bd_net -net completed [get_bd_pins wr_data_dir_adv_1/completed] [get_bd_pins completed1]
connect_bd_net [get_bd_pins frame_ptr_V] [get_bd_pins wr_data_dir_adv_1/frame_ptr]
connect_bd_net -net processing_system7_0_FCLK_CLK0 [get_bd_pins m_axi_mm2s_aclk] \
  [get_bd_pins axis_data_fifo_1/s_axis_aclk] [get_bd_pins axis_dir_fifo_1/s_axis_aclk] [get_bd_pins wr_data_dir_adv_1/ap_clk]
connect_bd_net -net processing_system7_0_FCLK_CLK1 [get_bd_pins m_axis_aclk] \
  [get_bd_pins adapter_axi_1/clk] [get_bd_pins axis_data_fifo_1/m_axis_aclk] [get_bd_pins axis_dir_fifo_1/m_axis_aclk]
connect_bd_net -net rst_ps7_0_50M_peripheral_aresetn [get_bd_pins axi_resetn] \
  [get_bd_pins axis_data_fifo_1/s_axis_aresetn] [get_bd_pins axis_dir_fifo_1/s_axis_aresetn] \
  [get_bd_pins wr_data_dir_adv_1/ap_rst_n]
set_property HDL_ATTRIBUTE.DEBUG true [get_bd_intf_nets Conn2]
set_property HDL_ATTRIBUTE.DEBUG true [get_bd_intf_nets adapter_axi_1_out_mm]
set_property HDL_ATTRIBUTE.DEBUG true [get_bd_intf_nets wr_data_dir_adv_0_s_data]
set_property HDL_ATTRIBUTE.MARK_DEBUG true [get_bd_intf_nets wr_data_dir_adv_0_s_data]
set_property HDL_ATTRIBUTE.DEBUG true [get_bd_intf_nets wr_data_dir_adv_0_s_dir]
set_property HDL_ATTRIBUTE.MARK_DEBUG true [get_bd_intf_nets wr_data_dir_adv_0_s_dir]
set_property HDL_ATTRIBUTE.DEBUG true [get_bd_nets completed]

current_bd_instance /
connect_bd_intf_net -intf_net Conn [get_bd_intf_pins system_ila_0/SLOT_9_AXIS] [get_bd_intf_pins write_module_1/S_AXIS]
connect_bd_intf_net -intf_net Conn1 [get_bd_intf_pins system_ila_0/SLOT_10_AXIS] [get_bd_intf_pins write_module_1/S_AXIS1]
connect_bd_intf_net -intf_net Conn2 [get_bd_intf_pins system_ila_0/SLOT_11_AXIS] [get_bd_intf_pins write_module_0/S_AXIS]
connect_bd_intf_net -intf_net Conn3 [get_bd_intf_pins system_ila_0/SLOT_12_AXIS] [get_bd_intf_pins write_module_0/S_AXIS1]
connect_bd_intf_net -intf_net adapter_axi_0_out_mm [get_bd_intf_pins processing_system7_0/S_AXI_HP1] [get_bd_intf_pins write_module_0/out_mm]
connect_bd_intf_net [get_bd_intf_pins processing_system7_0/S_AXI_HP1] [get_bd_intf_pins system_ila_0/SLOT_0_AXI]
connect_bd_intf_net -intf_net adapter_axi_1_out_mm [get_bd_intf_pins processing_system7_0/S_AXI_HP3] [get_bd_intf_pins write_module_1/out_mm]
connect_bd_intf_net [get_bd_intf_pins processing_system7_0/S_AXI_HP3] [get_bd_intf_pins system_ila_0/SLOT_1_AXI]
connect_bd_intf_net -intf_net axi_smc_1_M00_AXI1 [get_bd_intf_pins matrix_1/M00_AXI] [get_bd_intf_pins processing_system7_0/S_AXI_HP2]
connect_bd_intf_net [get_bd_intf_pins matrix_1/M00_AXI] [get_bd_intf_pins system_ila_0/SLOT_6_AXI]
connect_bd_intf_net -intf_net axi_smc_2_M00_AXI [get_bd_intf_pins display_0/M00_AXI] [get_bd_intf_pins processing_system7_0/S_AXI_GP0]
connect_bd_intf_net [get_bd_intf_pins display_0/M00_AXI] [get_bd_intf_pins system_ila_0/SLOT_7_AXI]
connect_bd_intf_net -intf_net axi_smc_3_M00_AXI [get_bd_intf_pins display_1/M00_AXI] [get_bd_intf_pins processing_system7_0/S_AXI_GP1]
connect_bd_intf_net [get_bd_intf_pins display_1/M00_AXI] [get_bd_intf_pins system_ila_0/SLOT_8_AXI]
connect_bd_intf_net -intf_net axi_smc_M00_AXI [get_bd_intf_pins matrix_0/M00_AXI] [get_bd_intf_pins processing_system7_0/S_AXI_HP0]
connect_bd_intf_net [get_bd_intf_pins matrix_0/M00_AXI] [get_bd_intf_pins system_ila_0/SLOT_2_AXI]
connect_bd_intf_net -intf_net axi_vdma_0_M_AXIS_MM2S [get_bd_intf_pins matrix_0/M_AXIS_MM2S] [get_bd_intf_pins write_module_0/strm_in]
connect_bd_intf_net [get_bd_intf_pins matrix_0/M_AXIS_MM2S] [get_bd_intf_pins system_ila_0/SLOT_3_AXIS]
connect_bd_intf_net -intf_net matrix_1_M_AXIS_MM2S [get_bd_intf_pins matrix_1/M_AXIS_MM2S] [get_bd_intf_pins write_module_1/strm_in]
connect_bd_intf_net [get_bd_intf_pins matrix_1/M_AXIS_MM2S] [get_bd_intf_pins system_ila_0/SLOT_4_AXIS]
connect_bd_intf_net [get_bd_intf_ports DDR] [get_bd_intf_pins processing_system7_0/DDR]
connect_bd_intf_net [get_bd_intf_ports FIXED_IO] [get_bd_intf_pins processing_system7_0/FIXED_IO]
connect_bd_intf_net -intf_net processing_system7_0_M_AXI_GP0 [get_bd_intf_pins processing_system7_0/M_AXI_GP0] [get_bd_intf_pins ps7_0_axi_periph/S00_AXI]
connect_bd_intf_net [get_bd_intf_pins processing_system7_0/M_AXI_GP0] [get_bd_intf_pins system_ila_0/SLOT_5_AXI]
connect_bd_intf_net [get_bd_intf_pins frame_ptrs/S_AXI] [get_bd_intf_pins ps7_0_axi_periph/M00_AXI]
connect_bd_intf_net [get_bd_intf_pins display_0/s_axi_Axi_lite] [get_bd_intf_pins ps7_0_axi_periph/M01_AXI]
connect_bd_intf_net [get_bd_intf_pins matrix_0/S_AXI_LITE] [get_bd_intf_pins ps7_0_axi_periph/M02_AXI]
connect_bd_intf_net [get_bd_intf_pins matrix_1/S_AXI_LITE] [get_bd_intf_pins ps7_0_axi_periph/M03_AXI]
connect_bd_intf_net [get_bd_intf_pins ps7_0_axi_periph/M04_AXI] [get_bd_intf_pins write_module_1/s_axi_Axi_lite]
connect_bd_intf_net [get_bd_intf_pins display_0/S_AXI_LITE] [get_bd_intf_pins ps7_0_axi_periph/M05_AXI]
connect_bd_intf_net [get_bd_intf_pins display_1/S_AXI_LITE] [get_bd_intf_pins ps7_0_axi_periph/M06_AXI]
connect_bd_intf_net [get_bd_intf_pins display_1/s_axi_Axi_lite] [get_bd_intf_pins ps7_0_axi_periph/M07_AXI]
connect_bd_intf_net [get_bd_intf_pins ps7_0_axi_periph/M08_AXI] [get_bd_intf_pins write_module_0/s_axi_Axi_lite]
connect_bd_net -net completed1 [get_bd_pins write_module_1/completed1] [get_bd_pins system_ila_0/probe3]
connect_bd_net -net completed1_1 [get_bd_pins write_module_0/completed1] [get_bd_pins system_ila_0/probe4]
connect_bd_net -net frame_ptr_V_1 [get_bd_pins frame_ptrs/gpio_io_o] [get_bd_pins write_module_0/frame_ptr_V] [get_bd_pins write_module_1/frame_ptr_V]
connect_bd_net [get_bd_pins processing_system7_0/FCLK_CLK0] \
  [get_bd_pins display_0/m_axi_mm2s_aclk] [get_bd_pins display_1/s_axi_lite_aclk] [get_bd_pins frame_ptrs/s_axi_aclk] \
  [get_bd_pins matrix_0/m_axi_mm2s_aclk] [get_bd_pins matrix_1/aclk] [get_bd_pins processing_system7_0/M_AXI_GP0_ACLK] \
  [get_bd_pins processing_system7_0/S_AXI_GP0_ACLK] [get_bd_pins processing_system7_0/S_AXI_GP1_ACLK] \
  [get_bd_pins processing_system7_0/S_AXI_HP0_ACLK] [get_bd_pins processing_system7_0/S_AXI_HP1_ACLK] \
  [get_bd_pins processing_system7_0/S_AXI_HP2_ACLK] [get_bd_pins processing_system7_0/S_AXI_HP3_ACLK] \
  [get_bd_pins ps7_0_axi_periph/ACLK] [get_bd_pins ps7_0_axi_periph/M00_ACLK] [get_bd_pins ps7_0_axi_periph/M01_ACLK] \
  [get_bd_pins ps7_0_axi_periph/M02_ACLK] [get_bd_pins ps7_0_axi_periph/M03_ACLK] [get_bd_pins ps7_0_axi_periph/M04_ACLK] \
  [get_bd_pins ps7_0_axi_periph/M05_ACLK] [get_bd_pins ps7_0_axi_periph/M06_ACLK] [get_bd_pins ps7_0_axi_periph/M07_ACLK] \
  [get_bd_pins ps7_0_axi_periph/M08_ACLK] [get_bd_pins ps7_0_axi_periph/S00_ACLK] \
  [get_bd_pins rst_ps7_0_50M/slowest_sync_clk] [get_bd_pins system_ila_0/clk] [get_bd_pins write_module_0/ap_clk] \
  [get_bd_pins write_module_0/m_axis_aclk] [get_bd_pins write_module_1/m_axi_mm2s_aclk] \
  [get_bd_pins write_module_1/m_axis_aclk]
connect_bd_net [get_bd_pins processing_system7_0/FCLK_RESET0_N] [get_bd_pins rst_ps7_0_50M/ext_reset_in]
connect_bd_net -net processing_system7_0_GPIO_O [get_bd_pins processing_system7_0/GPIO_O] \
  [get_bd_pins slice_4bit/Din] [get_bd_pins system_ila_0/probe0]
connect_bd_net -net received_V [get_bd_pins display_0/received_V] [get_bd_pins system_ila_0/probe1]
connect_bd_net -net received_V_1 [get_bd_pins display_1/received_V] [get_bd_pins system_ila_0/probe2]
connect_bd_net [get_bd_pins rst_ps7_0_50M/peripheral_aresetn] \
  [get_bd_pins display_0/aresetn] [get_bd_pins display_1/axi_resetn] [get_bd_pins frame_ptrs/s_axi_aresetn] \
  [get_bd_pins matrix_0/aresetn] [get_bd_pins matrix_1/aresetn] [get_bd_pins ps7_0_axi_periph/ARESETN] \
  [get_bd_pins ps7_0_axi_periph/M00_ARESETN] [get_bd_pins ps7_0_axi_periph/M01_ARESETN] \
  [get_bd_pins ps7_0_axi_periph/M02_ARESETN] [get_bd_pins ps7_0_axi_periph/M03_ARESETN] \
  [get_bd_pins ps7_0_axi_periph/M04_ARESETN] [get_bd_pins ps7_0_axi_periph/M05_ARESETN] \
  [get_bd_pins ps7_0_axi_periph/M06_ARESETN] [get_bd_pins ps7_0_axi_periph/M07_ARESETN] \
  [get_bd_pins ps7_0_axi_periph/M08_ARESETN] [get_bd_pins ps7_0_axi_periph/S00_ARESETN] [get_bd_pins system_ila_0/resetn] \
  [get_bd_pins write_module_0/ap_rst_n] [get_bd_pins write_module_1/axi_resetn]
connect_bd_net [get_bd_pins slice_4bit/Dout] [get_bd_pins matrix_1/mm2s_fsync]
connect_bd_net [get_bd_pins slice_4bit/Dout1] [get_bd_pins matrix_0/mm2s_fsync]
connect_bd_net [get_bd_pins slice_4bit/Dout2] [get_bd_pins display_0/mm2s_fsync]
connect_bd_net [get_bd_pins slice_4bit/Dout3] [get_bd_pins display_1/mm2s_fsync]
connect_bd_net -net xlconstant_0_dout [get_bd_pins frame_ptrs/gpio2_io_o] \
  [get_bd_pins display_0/mm2s_frame_ptr_in] [get_bd_pins display_1/mm2s_frame_ptr_in]
set_property HDL_ATTRIBUTE.DEBUG true [get_bd_intf_nets Conn]
set_property HDL_ATTRIBUTE.DEBUG true [get_bd_intf_nets Conn1]
set_property HDL_ATTRIBUTE.DEBUG true [get_bd_intf_nets Conn2]
set_property HDL_ATTRIBUTE.DEBUG true [get_bd_intf_nets Conn3]
set_property HDL_ATTRIBUTE.DEBUG true [get_bd_intf_nets adapter_axi_0_out_mm]
set_property HDL_ATTRIBUTE.MARK_DEBUG true [get_bd_intf_nets adapter_axi_0_out_mm]
set_property HDL_ATTRIBUTE.DEBUG true [get_bd_intf_nets adapter_axi_1_out_mm]
set_property HDL_ATTRIBUTE.MARK_DEBUG true [get_bd_intf_nets adapter_axi_1_out_mm]
set_property HDL_ATTRIBUTE.DEBUG true [get_bd_intf_nets axi_smc_1_M00_AXI1]
set_property HDL_ATTRIBUTE.MARK_DEBUG true [get_bd_intf_nets axi_smc_1_M00_AXI1]
set_property HDL_ATTRIBUTE.DEBUG true [get_bd_intf_nets axi_smc_2_M00_AXI]
set_property HDL_ATTRIBUTE.MARK_DEBUG true [get_bd_intf_nets axi_smc_2_M00_AXI]
set_property HDL_ATTRIBUTE.DEBUG true [get_bd_intf_nets axi_smc_3_M00_AXI]
set_property HDL_ATTRIBUTE.MARK_DEBUG true [get_bd_intf_nets axi_smc_3_M00_AXI]
set_property HDL_ATTRIBUTE.DEBUG true [get_bd_intf_nets axi_smc_M00_AXI]
set_property HDL_ATTRIBUTE.MARK_DEBUG true [get_bd_intf_nets axi_smc_M00_AXI]
set_property HDL_ATTRIBUTE.DEBUG true [get_bd_intf_nets axi_vdma_0_M_AXIS_MM2S]
set_property HDL_ATTRIBUTE.MARK_DEBUG true [get_bd_intf_nets axi_vdma_0_M_AXIS_MM2S]
set_property HDL_ATTRIBUTE.DEBUG true [get_bd_intf_nets matrix_1_M_AXIS_MM2S]
set_property HDL_ATTRIBUTE.MARK_DEBUG true [get_bd_intf_nets matrix_1_M_AXIS_MM2S]
set_property HDL_ATTRIBUTE.DEBUG true [get_bd_intf_nets processing_system7_0_M_AXI_GP0]
set_property HDL_ATTRIBUTE.MARK_DEBUG true [get_bd_intf_nets processing_system7_0_M_AXI_GP0]
set_property HDL_ATTRIBUTE.DEBUG true [get_bd_nets completed1]
set_property HDL_ATTRIBUTE.MARK_DEBUG true [get_bd_nets completed1]
set_property HDL_ATTRIBUTE.DEBUG true [get_bd_nets completed1_1]
set_property HDL_ATTRIBUTE.MARK_DEBUG true [get_bd_nets completed1_1]
set_property HDL_ATTRIBUTE.DEBUG true [get_bd_nets processing_system7_0_GPIO_O]
set_property HDL_ATTRIBUTE.MARK_DEBUG true [get_bd_nets processing_system7_0_GPIO_O]
set_property HDL_ATTRIBUTE.DEBUG true [get_bd_nets received_V]
set_property HDL_ATTRIBUTE.MARK_DEBUG true [get_bd_nets received_V]
set_property HDL_ATTRIBUTE.DEBUG true [get_bd_nets received_V_1]
set_property HDL_ATTRIBUTE.MARK_DEBUG true [get_bd_nets received_V_1]

# ---- address map ----
assign_bd_address -offset 0x00000000 -range 1G -target_address_space [get_bd_addr_spaces display_0/axi_vdma_display0/Data_MM2S] [get_bd_addr_segs processing_system7_0/S_AXI_GP0/GP0_DDR_LOWOCM]
assign_bd_address -offset 0xFC000000 -range 16M -target_address_space [get_bd_addr_spaces display_0/axi_vdma_display0/Data_MM2S] [get_bd_addr_segs processing_system7_0/S_AXI_GP0/GP0_QSPI_LINEAR]
exclude_bd_addr_seg -offset 0x40000000 -range 1G -target_address_space [get_bd_addr_spaces display_0/axi_vdma_display0/Data_MM2S] [get_bd_addr_segs processing_system7_0/S_AXI_GP0/GP0_M_AXI_GP0]
exclude_bd_addr_seg -offset 0xE0000000 -range 4M -target_address_space [get_bd_addr_spaces display_0/axi_vdma_display0/Data_MM2S] [get_bd_addr_segs processing_system7_0/S_AXI_GP0/GP0_IOP]
assign_bd_address -offset 0x00000000 -range 1G -target_address_space [get_bd_addr_spaces display_1/axi_vdma_display1/Data_MM2S] [get_bd_addr_segs processing_system7_0/S_AXI_GP1/GP1_DDR_LOWOCM]
assign_bd_address -offset 0xFC000000 -range 16M -target_address_space [get_bd_addr_spaces display_1/axi_vdma_display1/Data_MM2S] [get_bd_addr_segs processing_system7_0/S_AXI_GP1/GP1_QSPI_LINEAR]
exclude_bd_addr_seg -offset 0x40000000 -range 1G -target_address_space [get_bd_addr_spaces display_1/axi_vdma_display1/Data_MM2S] [get_bd_addr_segs processing_system7_0/S_AXI_GP1/GP1_M_AXI_GP0]
exclude_bd_addr_seg -offset 0xE0000000 -range 4M -target_address_space [get_bd_addr_spaces display_1/axi_vdma_display1/Data_MM2S] [get_bd_addr_segs processing_system7_0/S_AXI_GP1/GP1_IOP]
assign_bd_address -offset 0x00000000 -range 1G -target_address_space [get_bd_addr_spaces matrix_0/axi_vdma_0/Data_MM2S] [get_bd_addr_segs processing_system7_0/S_AXI_HP0/HP0_DDR_LOWOCM]
assign_bd_address -offset 0x00000000 -range 1G -target_address_space [get_bd_addr_spaces matrix_1/axi_vdma_1/Data_MM2S] [get_bd_addr_segs processing_system7_0/S_AXI_HP2/HP2_DDR_LOWOCM]
assign_bd_address -offset 0x40000000 -range 64K -target_address_space [get_bd_addr_spaces processing_system7_0/Data] [get_bd_addr_segs display_0/colector_display_0/s_axi_Axi_lite/Reg]
assign_bd_address -offset 0x40010000 -range 64K -target_address_space [get_bd_addr_spaces processing_system7_0/Data] [get_bd_addr_segs display_1/colector_display_1/s_axi_Axi_lite/Reg]
assign_bd_address -offset 0x40020000 -range 64K -target_address_space [get_bd_addr_spaces processing_system7_0/Data] [get_bd_addr_segs write_module_0/wr_data_dir_adv_0/s_axi_Axi_lite/Reg]
assign_bd_address -offset 0x40030000 -range 64K -target_address_space [get_bd_addr_spaces processing_system7_0/Data] [get_bd_addr_segs write_module_1/wr_data_dir_adv_1/s_axi_Axi_lite/Reg]
assign_bd_address -offset 0x41200000 -range 64K -target_address_space [get_bd_addr_spaces processing_system7_0/Data] [get_bd_addr_segs frame_ptrs/S_AXI/Reg]
assign_bd_address -offset 0x43000000 -range 64K -target_address_space [get_bd_addr_spaces processing_system7_0/Data] [get_bd_addr_segs display_0/axi_vdma_display0/S_AXI_LITE/Reg]
assign_bd_address -offset 0x43010000 -range 64K -target_address_space [get_bd_addr_spaces processing_system7_0/Data] [get_bd_addr_segs display_1/axi_vdma_display1/S_AXI_LITE/Reg]
assign_bd_address -offset 0x43020000 -range 64K -target_address_space [get_bd_addr_spaces processing_system7_0/Data] [get_bd_addr_segs matrix_0/axi_vdma_0/S_AXI_LITE/Reg]
assign_bd_address -offset 0x43030000 -range 64K -target_address_space [get_bd_addr_spaces processing_system7_0/Data] [get_bd_addr_segs matrix_1/axi_vdma_1/S_AXI_LITE/Reg]
assign_bd_address -offset 0x00000000 -range 1G -target_address_space [get_bd_addr_spaces write_module_0/adapter_axi_0/out_mm] [get_bd_addr_segs processing_system7_0/S_AXI_HP1/HP1_DDR_LOWOCM]
assign_bd_address -offset 0x00000000 -range 1G -target_address_space [get_bd_addr_spaces write_module_1/adapter_axi_1/out_mm] [get_bd_addr_segs processing_system7_0/S_AXI_HP3/HP3_DDR_LOWOCM]

validate_bd_design
save_bd_design
